# Altium schematic sheet mcu.SchDoc (part 2 of 2)
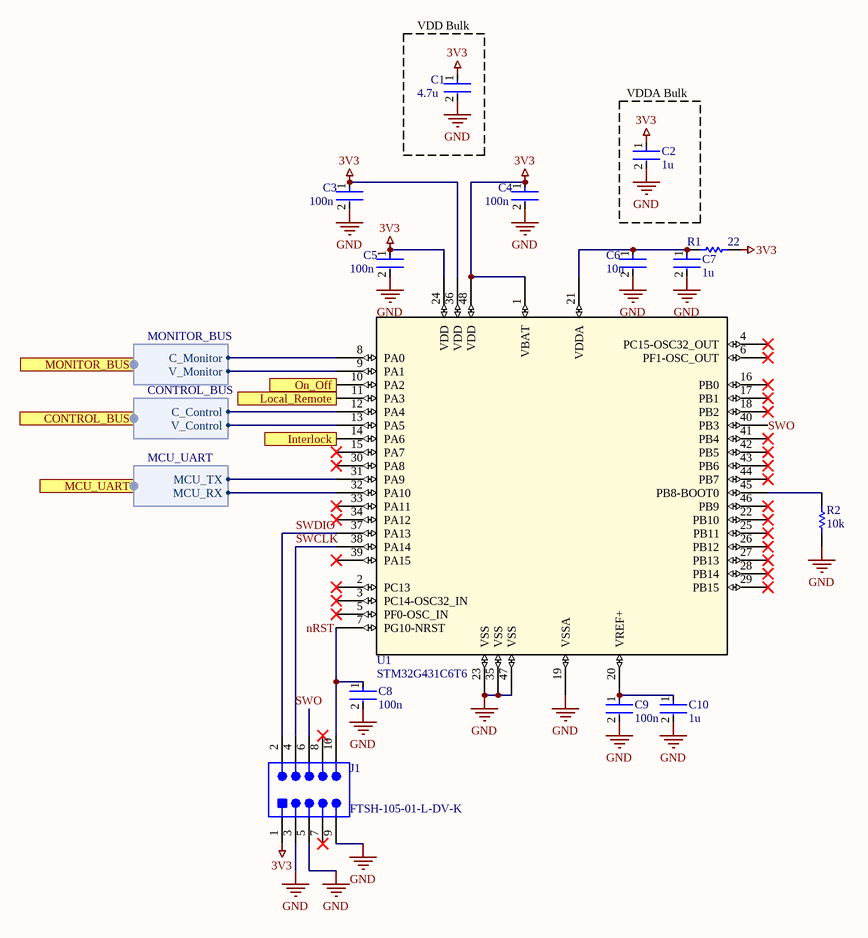
[diagram p1: mcu.SchDoc]

## Library data of the parts
C1 = CC0805KKX5R5BB475: Surface Mount Ceramic Multilayer Capacitor 4.7uF 10% X5R 6.3V 0805 Blister T/R; Manufacturer: Yageo Group; Manufacturer Package Identifier: CC0805-0.85; Value: 4.7µF; Supplier: DigiKey; Supplier Part Number: 311-1861-1-ND; Manufacturer Part Number: CC0805KKX5R5BB475; RoHS: Compliant; Category: Ceramic Capacitors; Stock: 20325; Pricing: 1=0.2, 10=0.112, 50=0.0796, 100=0.0696, 500=0.05296, 1000=0.04784 (USD); Case/Package: 0805; Case Code (Imperial): 0805; Case Code (Metric): 2012; China RoHS: Compliant; Composition: Ceramic; Country of Origin: Mainland China, Taiwan; Depth: 1.25mm; Dielectric: X5R; Dielectric Material: Ceramic; Export Control Classification Number (ECCN) Code: EAR99; Halogen Free: Halogen Free; Height: 1.25mm; Harmonized Tariff Schedule (HTS) Code: 8532.24.00.20; Introduction Date: 2006-06-01; Lead Free: Lead Free; Length: 2mm; Lifecycle Status: Production; Material: Ceramic; Max Operating Temperature: 85°C; Min Operating Temperature: -55°C; Mounting Technology: Surface Mount; Pins: 2; Number of Terminals: 2; Packaging: Tape & Reel (TR); Radiation Hardening: No; REACH SVHC: Yes; Schedule B: 8532240020, 8532240020|8532240020|8532240020|8532240020|8532240020; Termination: SMD/SMT; Thickness: 1.4478mm; Tolerance: 10%; Voltage Rating: 6.3V; Voltage Rating (DC): 6.3V; Weight: 5.499807mg; Width: 1.25mm; ComponentLink1URL: https://datasheet.octopart.com:443/CC0805KKX5R5BB475-Yageo-datasheet-170350636.pdf?src-supplier=IHS; ComponentLink1Description: https://datasheet.octopart.com:443/CC0805KKX5R5BB475-Yageo-datasheet-170350636.pdf?src-supplier=IHS; ComponentLink2URL: https://datasheet.octopart.com:443/CC0805KKX5R5BB475-Yageo-datasheet-78855689.pdf?src-supplier=Upverter; ComponentLink2Description: https://datasheet.octopart.com:443/CC0805KKX5R5BB475-Yageo-datasheet-78855689.pdf?src-supplier=Upverter; ComponentLink3URL: https://datasheet.octopart.com:443/CC0805KKX5R5BB475-Yageo-datasheet-140260304.pdf?src-supplier=element14+APAC; ComponentLink3Description: https://datasheet.octopart.com:443/CC0805KKX5R5BB475-Yageo-datasheet-140260304.pdf?src-supplier=element14+APAC; ComponentLink4URL: https://datasheet.octopart.com:443/CC0805KKX5R5BB475-Yageo-datasheet-182029903.pdf?src-supplier=Farnell; ComponentLink4Description: https://datasheet.octopart.com:443/CC0805KKX5R5BB475-Yageo-datasheet-182029903.pdf?src-supplier=Farnell; ComponentLink5URL: https://datasheet.octopart.com/CC0805KKX5R5BB475-Yageo-datasheet-86397281.pdf; ComponentLink5Description: https://datasheet.octopart.com/CC0805KKX5R5BB475-Yageo-datasheet-86397281.pdf; ComponentLink6URL: https://datasheet.octopart.com:443/CC0805KKX5R5BB475-Yageo-datasheet-8324442.pdf?src-supplier=Newark; ComponentLink6Description: https://datasheet.octopart.com:443/CC0805KKX5R5BB475-Yageo-datasheet-8324442.pdf?src-supplier=Newark; ComponentLink7URL: https://datasheet.octopart.com:443/CC0805KKX5R5BB475-Yageo-datasheet-158238148.pdf?src-supplier=Newark; ComponentLink7Description: https://datasheet.octopart.com:443/CC0805KKX5R5BB475-Yageo-datasheet-158238148.pdf?src-supplier=Newark; ComponentLink8URL: https://datasheet.octopart.com:443/CC0805KKX5R5BB475-Yageo-datasheet-62067349.pdf?src-supplier=Newark; ComponentLink8Description: https://datasheet.octopart.com:443/CC0805KKX5R5BB475-Yageo-datasheet-62067349.pdf?src-supplier=Newark; ComponentLink9URL: https://datasheet.octopart.com:443/CC0805KKX5R5BB475-Yageo-Group-datasheet-184398209.pdf?src-supplier=LCSC; ComponentLink9Description: https://datasheet.octopart.com:443/CC0805KKX5R5BB475-Yageo-Group-datasheet-184398209.pdf?src-supplier=LCSC; ComponentLink10URL: https://datasheet.octopart.com:443/CC0805KKX5R5BB475-Yageo-datasheet-149070021.pdf?src-supplier=TME; ComponentLink10Description: https://datasheet.octopart.com:443/CC0805KKX5R5BB475-Yageo-datasheet-149070021.pdf?src-supplier=TME; ComponentLink11URL: https://datasheet.octopart.com:443/CC0805KKX5R5BB475-Yageo-Group-datasheet-145016144.pdf?src-supplier=ODG+(Origin+Data+Global); ComponentLink11Description: https://datasheet.octopart.com:443/CC0805KKX5R5BB475-Yageo-Group-datasheet-145016144.pdf?src-supplier=ODG+(Origin+Data+Global); ComponentLink12URL: https://datasheet.octopart.com:443/CC0805KKX5R5BB475-Yageo-datasheet-137875056.pdf?src-supplier=Future+Electronics; ComponentLink12Description: https://datasheet.octopart.com:443/CC0805KKX5R5BB475-Yageo-datasheet-137875056.pdf?src-supplier=Future+Electronics; ComponentLink13URL: https://datasheet.octopart.com:443/CC0805KKX5R5BB475-Yageo-datasheet-137700082.pdf?src-supplier=Future+Electronics; ComponentLink13Description: https://datasheet.octopart.com:443/CC0805KKX5R5BB475-Yageo-datasheet-137700082.pdf?src-supplier=Future+Electronics; ComponentLink14URL: https://datasheet.octopart.com:443/CC0805KKX5R5BB475-Yageo-datasheet-137700085.pdf?src-supplier=Future+Electronics; ComponentLink14Description: https://datasheet.octopart.com:443/CC0805KKX5R5BB475-Yageo-datasheet-137700085.pdf?src-supplier=Future+Electronics; ComponentLink15URL: https://datasheet.octopart.com:443/CC0805KKX5R5BB475-Yageo-datasheet-24580494.pdf?src-supplier=Future+Electronics; ComponentLink15Description: https://datasheet.octopart.com:443/CC0805KKX5R5BB475-Yageo-datasheet-24580494.pdf?src-supplier=Future+Electronics; ComponentLink16URL: https://datasheet.octopart.com:443/CC0805KKX5R5BB475-Yageo-datasheet-14389981.pdf?src-supplier=Future+Electronics; ComponentLink16Description: https://datasheet.octopart.com:443/CC0805KKX5R5BB475-Yageo-datasheet-14389981.pdf?src-supplier=Future+Electronics; ComponentLink17URL: https://datasheet.octopart.com:443/CC0805KKX5R5BB475-Yageo-datasheet-10911834.pdf?src-supplier=Future+Electronics; ComponentLink17Description: https://datasheet.octopart.com:443/CC0805KKX5R5BB475-Yageo-datasheet-10911834.pdf?src-supplier=Future+Electronics; ComponentLink18URL: http://sigma.octopart.com:80/conflict_mineral_statement/Yageo-company-3.pdf?src-supplier=Compliance+Statements; ComponentLink18Description: http://sigma.octopart.com:80/conflict_mineral_statement/Yageo-company-3.pdf?src-supplier=Compliance+Statements; ComponentLink19URL: http://sigma.octopart.com:80/rohs_statement/Yageo-company-2.pdf?src-supplier=Compliance+Statements; ComponentLink19Description: http://sigma.octopart.com:80/rohs_statement/Yageo-company-2.pdf?src-supplier=Compliance+Statements; Supplier 1: DigiKey; Supplier Part Number 1: 311-1861-1-ND
C2 C10 = CC0603MRX5R5BB105: 6.3V 1uF X5R ±20% 0603 Multilayer Ceramic Capacitors MLCC - SMD/SMT ROHS; Manufacturer: Yageo Group; Value: 1µF; Supplier: DigiKey; Supplier Part Number: 311-1813-1-ND; Manufacturer Part Number: CC0603MRX5R5BB105; RoHS: Compliant; Category: Ceramic Capacitors; Stock: 3638; Pricing: 1=0.14, 10=0.078, 50=0.0544, 100=0.0472, 500=0.03518, 1000=0.03148 (USD); Case/Package: 0603; Case Code (Imperial): 0603; Case Code (Metric): 1608; China RoHS: Compliant; Composition: Ceramic; Country of Origin: Mainland China, Taiwan; Depth: 800µm; Dielectric: X5R; Dielectric Material: Ceramic; Export Control Classification Number (ECCN) Code: EAR99; Halogen Free: Halogen Free; Height: 800µm; Harmonized Tariff Schedule (HTS) Code: 8532.24.00.20; Introduction Date: 2009-04-16; Lead Free: Lead Free; Length: 1.6mm; Lifecycle Status: Production; Material: Ceramic; Max Operating Temperature: 85°C; Min Operating Temperature: -55°C; Mounting Technology: Surface Mount; Pins: 2; Number of Terminals: 2; Packaging: Tape & Reel (TR); REACH SVHC: Yes; Schedule B: 8532240020, 8532240020|8532240020|8532240020|8532240020|8532240020; Termination: SMD/SMT; Thickness: 889µm; Tolerance: 20%; Voltage Rating: 6.3V; Voltage Rating (DC): 6.3V; Weight: 2.012816mg; Width: 800µm; ComponentLink1URL: https://datasheet.octopart.com:443/CC0603MRX5R5BB105-Yageo-datasheet-170350636.pdf?src-supplier=IHS; ComponentLink1Description: https://datasheet.octopart.com:443/CC0603MRX5R5BB105-Yageo-datasheet-170350636.pdf?src-supplier=IHS; ComponentLink2URL: https://datasheet.octopart.com:443/CC0603MRX5R5BB105-Yageo-datasheet-82288757.pdf?src-supplier=Upverter; ComponentLink2Description: https://datasheet.octopart.com:443/CC0603MRX5R5BB105-Yageo-datasheet-82288757.pdf?src-supplier=Upverter; ComponentLink3URL: https://datasheet.octopart.com:443/CC0603MRX5R5BB105-Yageo-datasheet-181968798.pdf?src-supplier=Farnell; ComponentLink3Description: https://datasheet.octopart.com:443/CC0603MRX5R5BB105-Yageo-datasheet-181968798.pdf?src-supplier=Farnell; ComponentLink4URL: https://datasheet.octopart.com/CC0603MRX5R5BB105-Yageo-datasheet-86397281.pdf; ComponentLink4Description: https://datasheet.octopart.com/CC0603MRX5R5BB105-Yageo-datasheet-86397281.pdf; ComponentLink5URL: https://datasheet.octopart.com:443/CC0603MRX5R5BB105-Yageo-datasheet-8324442.pdf?src-supplier=Newark; ComponentLink5Description: https://datasheet.octopart.com:443/CC0603MRX5R5BB105-Yageo-datasheet-8324442.pdf?src-supplier=Newark; ComponentLink6URL: https://datasheet.octopart.com:443/CC0603MRX5R5BB105-Yageo-Group-datasheet-184398209.pdf?src-supplier=LCSC; ComponentLink6Description: https://datasheet.octopart.com:443/CC0603MRX5R5BB105-Yageo-Group-datasheet-184398209.pdf?src-supplier=LCSC; ComponentLink7URL: https://datasheet.octopart.com:443/CC0603MRX5R5BB105-Yageo-Group-datasheet-145016144.pdf?src-supplier=ODG+(Origin+Data+Global); ComponentLink7Description: https://datasheet.octopart.com:443/CC0603MRX5R5BB105-Yageo-Group-datasheet-145016144.pdf?src-supplier=ODG+(Origin+Data+Global); ComponentLink8URL: https://datasheet.octopart.com:443/CC0603MRX5R5BB105-Yageo-datasheet-137875056.pdf?src-supplier=Future+Electronics; ComponentLink8Description: https://datasheet.octopart.com:443/CC0603MRX5R5BB105-Yageo-datasheet-137875056.pdf?src-supplier=Future+Electronics; ComponentLink9URL: https://datasheet.octopart.com:443/CC0603MRX5R5BB105-Yageo-datasheet-137700082.pdf?src-supplier=Future+Electronics; ComponentLink9Description: https://datasheet.octopart.com:443/CC0603MRX5R5BB105-Yageo-datasheet-137700082.pdf?src-supplier=Future+Electronics; ComponentLink10URL: https://datasheet.octopart.com:443/CC0603MRX5R5BB105-Yageo-datasheet-137700085.pdf?src-supplier=Future+Electronics; ComponentLink10Description: https://datasheet.octopart.com:443/CC0603MRX5R5BB105-Yageo-datasheet-137700085.pdf?src-supplier=Future+Electronics; ComponentLink11URL: https://datasheet.octopart.com:443/CC0603MRX5R5BB105-Yageo-datasheet-15895757.pdf?src-supplier=Future+Electronics; ComponentLink11Description: https://datasheet.octopart.com:443/CC0603MRX5R5BB105-Yageo-datasheet-15895757.pdf?src-supplier=Future+Electronics; ComponentLink12URL: https://datasheet.octopart.com:443/CC0603MRX5R5BB105-Yageo-datasheet-14389981.pdf?src-supplier=Future+Electronics; ComponentLink12Description: https://datasheet.octopart.com:443/CC0603MRX5R5BB105-Yageo-datasheet-14389981.pdf?src-supplier=Future+Electronics; ComponentLink13URL: https://datasheet.octopart.com:443/CC0603MRX5R5BB105-Yageo-datasheet-10911834.pdf?src-supplier=Future+Electronics; ComponentLink13Description: https://datasheet.octopart.com:443/CC0603MRX5R5BB105-Yageo-datasheet-10911834.pdf?src-supplier=Future+Electronics; ComponentLink14URL: http://sigma.octopart.com:80/conflict_mineral_statement/Yageo-company-3.pdf?src-supplier=Compliance+Statements; ComponentLink14Description: http://sigma.octopart.com:80/conflict_mineral_statement/Yageo-company-3.pdf?src-supplier=Compliance+Statements; ComponentLink15URL: http://sigma.octopart.com:80/rohs_statement/Yageo-company-2.pdf?src-supplier=Compliance+Statements; ComponentLink15Description: http://sigma.octopart.com:80/rohs_statement/Yageo-company-2.pdf?src-supplier=Compliance+Statements; Supplier 1: DigiKey; Supplier Part Number 1: 311-1813-1-ND
C3-C5 C8 C9 = CC0603KRX7R9BB104: Multilayer Ceramic Capacitor, CC Series, 0.1 - F, - 10%, X7R, 50 V, 0603 [1608 Metric]; Manufacturer: Yageo Group; Value: 100nF; Voltage: 50V; Supplier: DigiKey; Supplier Part Number: 311-1344-1-ND; Manufacturer Part Number: CC0603KRX7R9BB104; RoHS: Compliant; Category: Ceramic Capacitors; Stock: 3228292; Pricing: 1=0.1, 10=0.043, 50=0.0292, 100=0.0251, 500=0.01812, 1000=0.01598 (USD); Case/Package: 0603; Case Code (Imperial): 0603; Case Code (Metric): 1608; China RoHS: Compliant; Country of Origin: Mainland China, Taiwan; Depth: 800µm; Dielectric: X7R; Dielectric Material: Ceramic; Export Control Classification Number (ECCN) Code: EAR99; Halogen Free: Halogen Free; Height: 800µm; Harmonized Tariff Schedule (HTS) Code: 8532.24.00.20; Introduction Date: 2005-08-18; Lead Free: Lead Free; Length: 1.6mm; Lifecycle Status: Production; Material: Ceramic; Max Operating Temperature: 125°C; Min Operating Temperature: -55°C; Mounting Technology: Surface Mount; Pins: 2; Number of Terminals: 2; Radiation Hardening: No; REACH SVHC: Yes; Schedule B: 8532240020, 8532240020|8532240020, 8532240020|8532240020|8532240020, 8532240020|8532240020|8532240020|8532240020; Termination: SMD/SMT; Thickness: 889µm; Tolerance: 10%; Voltage Rating: 50V; Voltage Rating (DC): 50V; Width: 800µm; ComponentLink1URL: https://datasheet.octopart.com:443/CC0603KRX7R9BB104-Yageo-datasheet-177165144.pdf?src-supplier=IHS; ComponentLink1Description: https://datasheet.octopart.com:443/CC0603KRX7R9BB104-Yageo-datasheet-177165144.pdf?src-supplier=IHS; ComponentLink2URL: https://datasheet.octopart.com:443/CC0603KRX7R9BB104-Yageo-datasheet-82288757.pdf?src-supplier=Upverter; ComponentLink2Description: https://datasheet.octopart.com:443/CC0603KRX7R9BB104-Yageo-datasheet-82288757.pdf?src-supplier=Upverter; ComponentLink3URL: https://datasheet.octopart.com:443/CC0603KRX7R9BB104-Yageo-datasheet-68298032.pdf?src-supplier=Upverter; ComponentLink3Description: https://datasheet.octopart.com:443/CC0603KRX7R9BB104-Yageo-datasheet-68298032.pdf?src-supplier=Upverter; ComponentLink4URL: https://datasheet.octopart.com:443/CC0603KRX7R9BB104-Yageo-Group-datasheet-189192896.pdf?src-supplier=Future+Electronics; ComponentLink4Description: https://datasheet.octopart.com:443/CC0603KRX7R9BB104-Yageo-Group-datasheet-189192896.pdf?src-supplier=Future+Electronics; ComponentLink5URL: https://datasheet.octopart.com:443/CC0603KRX7R9BB104-Yageo-datasheet-12526321.pdf?src-supplier=Future+Electronics; ComponentLink5Description: https://datasheet.octopart.com:443/CC0603KRX7R9BB104-Yageo-datasheet-12526321.pdf?src-supplier=Future+Electronics; ComponentLink6URL: https://datasheet.octopart.com:443/CC0603KRX7R9BB104-Yageo-datasheet-166511530.pdf?src-supplier=Future+Electronics; ComponentLink6Description: https://datasheet.octopart.com:443/CC0603KRX7R9BB104-Yageo-datasheet-166511530.pdf?src-supplier=Future+Electronics; ComponentLink7URL: https://datasheet.octopart.com:443/CC0603KRX7R9BB104-Yageo-datasheet-137700082.pdf?src-supplier=Future+Electronics; ComponentLink7Description: https://datasheet.octopart.com:443/CC0603KRX7R9BB104-Yageo-datasheet-137700082.pdf?src-supplier=Future+Electronics; ComponentLink8URL: https://datasheet.octopart.com:443/CC0603KRX7R9BB104-Yageo-datasheet-137700084.pdf?src-supplier=Future+Electronics; ComponentLink8Description: https://datasheet.octopart.com:443/CC0603KRX7R9BB104-Yageo-datasheet-137700084.pdf?src-supplier=Future+Electronics; ComponentLink9URL: https://datasheet.octopart.com:443/CC0603KRX7R9BB104-Yageo-datasheet-27626582.pdf?src-supplier=Future+Electronics; ComponentLink9Description: https://datasheet.octopart.com:443/CC0603KRX7R9BB104-Yageo-datasheet-27626582.pdf?src-supplier=Future+Electronics; ComponentLink10URL: https://datasheet.octopart.com:443/CC0603KRX7R9BB104-Yageo-datasheet-15895757.pdf?src-supplier=Future+Electronics; ComponentLink10Description: https://datasheet.octopart.com:443/CC0603KRX7R9BB104-Yageo-datasheet-15895757.pdf?src-supplier=Future+Electronics; ComponentLink11URL: https://datasheet.octopart.com:443/CC0603KRX7R9BB104-Yageo-datasheet-8324192.pdf?src-supplier=Future+Electronics; ComponentLink11Description: https://datasheet.octopart.com:443/CC0603KRX7R9BB104-Yageo-datasheet-8324192.pdf?src-supplier=Future+Electronics; ComponentLink12URL: https://datasheet.octopart.com/CC0603KRX7R9BB104-Yageo-datasheet-10883670.pdf; ComponentLink12Description: https://datasheet.octopart.com/CC0603KRX7R9BB104-Yageo-datasheet-10883670.pdf; ComponentLink13URL: https://datasheet.octopart.com:443/CC0603KRX7R9BB104-Yageo-datasheet-181968726.pdf?src-supplier=Newark; ComponentLink13Description: https://datasheet.octopart.com:443/CC0603KRX7R9BB104-Yageo-datasheet-181968726.pdf?src-supplier=Newark; ComponentLink14URL: https://datasheet.octopart.com:443/CC0603KRX7R9BB104-Yageo-datasheet-499490.pdf?src-supplier=Newark; ComponentLink14Description: https://datasheet.octopart.com:443/CC0603KRX7R9BB104-Yageo-datasheet-499490.pdf?src-supplier=Newark; ComponentLink15URL: https://datasheet.octopart.com:443/CC0603KRX7R9BB104-Yageo-datasheet-62336348.pdf?src-supplier=Newark; ComponentLink15Description: https://datasheet.octopart.com:443/CC0603KRX7R9BB104-Yageo-datasheet-62336348.pdf?src-supplier=Newark; ComponentLink16URL: https://datasheet.octopart.com:443/CC0603KRX7R9BB104-Yageo-datasheet-147453679.pdf?src-supplier=Newark; ComponentLink16Description: https://datasheet.octopart.com:443/CC0603KRX7R9BB104-Yageo-datasheet-147453679.pdf?src-supplier=Newark; ComponentLink17URL: https://datasheet.octopart.com:443/CC0603KRX7R9BB104-Yageo-datasheet-151948686.pdf?src-supplier=Farnell; ComponentLink17Description: https://datasheet.octopart.com:443/CC0603KRX7R9BB104-Yageo-datasheet-151948686.pdf?src-supplier=Farnell; ComponentLink18URL: https://datasheet.octopart.com:443/CC0603KRX7R9BB104-Yageo-datasheet-500777.pdf?src-supplier=Farnell; ComponentLink18Description: https://datasheet.octopart.com:443/CC0603KRX7R9BB104-Yageo-datasheet-500777.pdf?src-supplier=Farnell; ComponentLink19URL: https://datasheet.octopart.com:443/CC0603KRX7R9BB104-Yageo-datasheet-178019014.pdf?src-supplier=Burklin+Elektronik; ComponentLink19Description: https://datasheet.octopart.com:443/CC0603KRX7R9BB104-Yageo-datasheet-178019014.pdf?src-supplier=Burklin+Elektronik; ComponentLink20URL: https://datasheet.octopart.com:443/CC0603KRX7R9BB104-Yageo-Group-datasheet-165992755.pdf?src-supplier=ODG+(Origin+Data+Global); ComponentLink20Description: https://datasheet.octopart.com:443/CC0603KRX7R9BB104-Yageo-Group-datasheet-165992755.pdf?src-supplier=ODG+(Origin+Data+Global); ComponentLink21URL: https://datasheet.octopart.com:443/CC0603KRX7R9BB104-Yageo-datasheet-140260305.pdf?src-supplier=SOS+electronic; ComponentLink21Description: https://datasheet.octopart.com:443/CC0603KRX7R9BB104-Yageo-datasheet-140260305.pdf?src-supplier=SOS+electronic; ComponentLink22URL: https://datasheet.octopart.com:443/CC0603KRX7R9BB104-Yageo-datasheet-120101875.pdf?src-supplier=Megastar; ComponentLink22Description: https://datasheet.octopart.com:443/CC0603KRX7R9BB104-Yageo-datasheet-120101875.pdf?src-supplier=Megastar; ComponentLink23URL: https://datasheet.octopart.com:443/CC0603KRX7R9BB104-Yageo-datasheet-8701427.pdf?src-supplier=element14; ComponentLink23Description: https://datasheet.octopart.com:443/CC0603KRX7R9BB104-Yageo-datasheet-8701427.pdf?src-supplier=element14; ComponentLink24URL: https://datasheet.octopart.com:443/CC0603KRX7R9BB104-Yageo-datasheet-5301394.pdf?src-supplier=element14; ComponentLink24Description: https://datasheet.octopart.com:443/CC0603KRX7R9BB104-Yageo-datasheet-5301394.pdf?src-supplier=element14; ComponentLink25URL: https://datasheet.octopart.com:443/CC0603KRX7R9BB104-Yageo-datasheet-17600895.pdf?src-supplier=TME; ComponentLink25Description: https://datasheet.octopart.com:443/CC0603KRX7R9BB104-Yageo-datasheet-17600895.pdf?src-supplier=TME; ComponentLink26URL: http://sigma.octopart.com:80/15889575/rohs_statement/Yageo-CC0603KRX7R9BB104.pdf?src-supplier=Compliance+Statements; ComponentLink26Description: http://sigma.octopart.com:80/15889575/rohs_statement/Yageo-CC0603KRX7R9BB104.pdf?src-supplier=Compliance+Statements; ComponentLink27URL: http://sigma.octopart.com:80/conflict_mineral_statement/Yageo-company-3.pdf?src-supplier=Compliance+Statements; ComponentLink27Description: http://sigma.octopart.com:80/conflict_mineral_statement/Yageo-company-3.pdf?src-supplier=Compliance+Statements; Supplier 1: DigiKey; Supplier Part Number 1: 311-1344-1-ND
C6 = CC0603MRX7R9BB103: 50V 10nF X7R ±20% 0603 Multilayer Ceramic Capacitors MLCC - SMD/SMT ROHS; Manufacturer: Yageo Group; Supplier: DigiKey; Supplier Part Number: 311-1826-1-ND; Manufacturer Part Number: CC0603MRX7R9BB103; RoHS: Compliant; Category: Ceramic Capacitors; Stock: 1798; Pricing: 1=0.1, 10=0.032, 50=0.0214, 100=0.0182, 500=0.01294, 1000=0.01133 (USD); Value: 10nF; Case/Package: 0603; Case Code (Imperial): 0603; Case Code (Metric): 1608; China RoHS: Compliant; Composition: Ceramic; Country of Origin: Mainland China, Taiwan; Depth: 800µm; Dielectric: X7R; Dielectric Material: Ceramic; Export Control Classification Number (ECCN) Code: EAR99; Halogen Free: Halogen Free; Height: 800µm; Harmonized Tariff Schedule (HTS) Code: 8532.24.00.20; Introduction Date: 2009-04-17; Lead Free: Lead Free; Length: 1.6mm; Lifecycle Status: Production; Material: Ceramic; Max Operating Temperature: 125°C; Min Operating Temperature: -55°C; Mounting Technology: Surface Mount; Pins: 2; Number of Terminals: 2; Packaging: Tape and Reel; Radiation Hardening: No; REACH SVHC: Yes; Schedule B: 8532240020, 8532240020|8532240020|8532240020|8532240020|8532240020; Termination: SMD/SMT; Thickness: 889µm; Tolerance: 20%; Voltage Rating: 50V; Voltage Rating (DC): 50V; Weight: 2.012816mg; Width: 800µm; ComponentLink1URL: https://datasheet.octopart.com:443/CC0603MRX7R9BB103-Yageo-datasheet-177165144.pdf?src-supplier=IHS; ComponentLink1Description: https://datasheet.octopart.com:443/CC0603MRX7R9BB103-Yageo-datasheet-177165144.pdf?src-supplier=IHS; ComponentLink2URL: https://datasheet.octopart.com:443/CC0603MRX7R9BB103-Yageo-datasheet-82288757.pdf?src-supplier=Upverter; ComponentLink2Description: https://datasheet.octopart.com:443/CC0603MRX7R9BB103-Yageo-datasheet-82288757.pdf?src-supplier=Upverter; ComponentLink3URL: https://datasheet.octopart.com:443/CC0603MRX7R9BB103-Yageo-datasheet-147453679.pdf?src-supplier=Farnell; ComponentLink3Description: https://datasheet.octopart.com:443/CC0603MRX7R9BB103-Yageo-datasheet-147453679.pdf?src-supplier=Farnell; ComponentLink4URL: https://datasheet.octopart.com:443/CC0603MRX7R9BB103-Yageo-datasheet-182029748.pdf?src-supplier=Farnell; ComponentLink4Description: https://datasheet.octopart.com:443/CC0603MRX7R9BB103-Yageo-datasheet-182029748.pdf?src-supplier=Farnell; ComponentLink5URL: https://datasheet.octopart.com:443/CC0603MRX7R9BB103-Yageo-datasheet-182029747.pdf?src-supplier=Farnell; ComponentLink5Description: https://datasheet.octopart.com:443/CC0603MRX7R9BB103-Yageo-datasheet-182029747.pdf?src-supplier=Farnell; ComponentLink6URL: https://datasheet.octopart.com:443/CC0603MRX7R9BB103-Yageo-datasheet-151948686.pdf?src-supplier=Farnell; ComponentLink6Description: https://datasheet.octopart.com:443/CC0603MRX7R9BB103-Yageo-datasheet-151948686.pdf?src-supplier=Farnell; ComponentLink7URL: https://datasheet.octopart.com:443/CC0603MRX7R9BB103-Yageo-datasheet-62336348.pdf?src-supplier=element14+APAC; ComponentLink7Description: https://datasheet.octopart.com:443/CC0603MRX7R9BB103-Yageo-datasheet-62336348.pdf?src-supplier=element14+APAC; ComponentLink8URL: https://datasheet.octopart.com/CC0603MRX7R9BB103-Yageo-datasheet-10883670.pdf; ComponentLink8Description: https://datasheet.octopart.com/CC0603MRX7R9BB103-Yageo-datasheet-10883670.pdf; ComponentLink9URL: https://datasheet.octopart.com:443/CC0603MRX7R9BB103-Yageo-datasheet-166511530.pdf?src-supplier=Future+Electronics; ComponentLink9Description: https://datasheet.octopart.com:443/CC0603MRX7R9BB103-Yageo-datasheet-166511530.pdf?src-supplier=Future+Electronics; ComponentLink10URL: https://datasheet.octopart.com:443/CC0603MRX7R9BB103-Yageo-datasheet-137700082.pdf?src-supplier=Future+Electronics; ComponentLink10Description: https://datasheet.octopart.com:443/CC0603MRX7R9BB103-Yageo-datasheet-137700082.pdf?src-supplier=Future+Electronics; ComponentLink11URL: https://datasheet.octopart.com:443/CC0603MRX7R9BB103-Yageo-datasheet-27626582.pdf?src-supplier=Future+Electronics; ComponentLink11Description: https://datasheet.octopart.com:443/CC0603MRX7R9BB103-Yageo-datasheet-27626582.pdf?src-supplier=Future+Electronics; ComponentLink12URL: https://datasheet.octopart.com:443/CC0603MRX7R9BB103-Yageo-datasheet-15895757.pdf?src-supplier=Future+Electronics; ComponentLink12Description: https://datasheet.octopart.com:443/CC0603MRX7R9BB103-Yageo-datasheet-15895757.pdf?src-supplier=Future+Electronics; ComponentLink13URL: https://datasheet.octopart.com:443/CC0603MRX7R9BB103-Yageo-datasheet-12526321.pdf?src-supplier=Future+Electronics; ComponentLink13Description: https://datasheet.octopart.com:443/CC0603MRX7R9BB103-Yageo-datasheet-12526321.pdf?src-supplier=Future+Electronics; ComponentLink14URL: https://datasheet.octopart.com:443/CC0603MRX7R9BB103-Yageo-datasheet-10882999.pdf?src-supplier=Future+Electronics; ComponentLink14Description: https://datasheet.octopart.com:443/CC0603MRX7R9BB103-Yageo-datasheet-10882999.pdf?src-supplier=Future+Electronics; ComponentLink15URL: https://datasheet.octopart.com:443/CC0603MRX7R9BB103-Yageo-Group-datasheet-165992755.pdf?src-supplier=ODG+(Origin+Data+Global); ComponentLink15Description: https://datasheet.octopart.com:443/CC0603MRX7R9BB103-Yageo-Group-datasheet-165992755.pdf?src-supplier=ODG+(Origin+Data+Global); ComponentLink16URL: http://sigma.octopart.com:80/conflict_mineral_statement/Yageo-company-3.pdf?src-supplier=Compliance+Statements; ComponentLink16Description: http://sigma.octopart.com:80/conflict_mineral_statement/Yageo-company-3.pdf?src-supplier=Compliance+Statements; ComponentLink17URL: http://sigma.octopart.com:80/rohs_statement/Yageo-company-2.pdf?src-supplier=Compliance+Statements; ComponentLink17Description: http://sigma.octopart.com:80/rohs_statement/Yageo-company-2.pdf?src-supplier=Compliance+Statements; Supplier 1: DigiKey; Supplier Part Number 1: 311-1826-1-ND
C7 = CC0805KKX5R5BB105: 6.3V 1uF X5R ±10% 0805 Multilayer Ceramic Capacitors MLCC - SMD/SMT ROHS; Manufacturer: Yageo Group; Manufacturer Package Identifier: CC0805-0.85; Value: 1µF; Supplier: DigiKey; Supplier Part Number: 311-3417-1-ND; Manufacturer Part Number: CC0805KKX5R5BB105; RoHS: Compliant; Category: Ceramic Capacitors; Stock: 24303; Pricing: 1=0.17, 10=0.096, 50=0.0676, 100=0.059, 500=0.0445, 1000=0.04003 (USD); Case/Package: 0805; China RoHS: Compliant; Country of Origin: Mainland China, Taiwan; Dielectric: X5R; Dielectric Material: Ceramic; Export Control Classification Number (ECCN) Code: EAR99; Halogen Free: Halogen Free; Height: 1.25mm; Harmonized Tariff Schedule (HTS) Code: 8532.24.00.20; Introduction Date: 2009-04-16; Lead Free: Lead Free; Length: 2mm; Lifecycle Status: Production; Material: Ceramic; Max Operating Temperature: 85°C; Min Operating Temperature: -55°C; Mounting Technology: Surface Mount; Number of Terminals: 2; REACH SVHC: Yes; Schedule B: 8532240020, 8532240020|8532240020, 8532240020|8532240020|8532240020, 8532240020|8532240020|8532240020|8532240020; Thickness: 1.4478mm; Tolerance: 10%; Voltage Rating: 6.3V; Voltage Rating (DC): 6.3V; Width: 1.25mm; ComponentLink1URL: https://datasheet.octopart.com:443/CC0805KKX5R5BB105-Yageo-datasheet-170350636.pdf?src-supplier=IHS; ComponentLink1Description: https://datasheet.octopart.com:443/CC0805KKX5R5BB105-Yageo-datasheet-170350636.pdf?src-supplier=IHS; ComponentLink2URL: https://datasheet.octopart.com:443/CC0805KKX5R5BB105-Yageo-datasheet-78855689.pdf?src-supplier=Upverter; ComponentLink2Description: https://datasheet.octopart.com:443/CC0805KKX5R5BB105-Yageo-datasheet-78855689.pdf?src-supplier=Upverter; ComponentLink3URL: https://datasheet.octopart.com:443/CC0805KKX5R5BB105-Yageo-datasheet-182965640.pdf?src-supplier=Farnell; ComponentLink3Description: https://datasheet.octopart.com:443/CC0805KKX5R5BB105-Yageo-datasheet-182965640.pdf?src-supplier=Farnell; ComponentLink4URL: https://datasheet.octopart.com:443/CC0805KKX5R5BB105-Yageo-Group-datasheet-184398209.pdf?src-supplier=LCSC; ComponentLink4Description: https://datasheet.octopart.com:443/CC0805KKX5R5BB105-Yageo-Group-datasheet-184398209.pdf?src-supplier=LCSC; ComponentLink5URL: https://datasheet.octopart.com:443/CC0805KKX5R5BB105-Yageo-Group-datasheet-145016144.pdf?src-supplier=ODG+(Origin+Data+Global); ComponentLink5Description: https://datasheet.octopart.com:443/CC0805KKX5R5BB105-Yageo-Group-datasheet-145016144.pdf?src-supplier=ODG+(Origin+Data+Global); ComponentLink6URL: https://datasheet.octopart.com/CC0805KKX5R5BB105-Yageo-datasheet-86397281.pdf; ComponentLink6Description: https://datasheet.octopart.com/CC0805KKX5R5BB105-Yageo-datasheet-86397281.pdf; ComponentLink7URL: http://sigma.octopart.com:80/conflict_mineral_statement/Yageo-company-3.pdf?src-supplier=Compliance+Statements; ComponentLink7Description: http://sigma.octopart.com:80/conflict_mineral_statement/Yageo-company-3.pdf?src-supplier=Compliance+Statements; ComponentLink8URL: http://sigma.octopart.com:80/rohs_statement/Yageo-company-2.pdf?src-supplier=Compliance+Statements; ComponentLink8Description: http://sigma.octopart.com:80/rohs_statement/Yageo-company-2.pdf?src-supplier=Compliance+Statements; Supplier 1: DigiKey; Supplier Part Number 1: 311-3417-1-ND
J1 = FTSH-105-01-L-DV-K: CONN HEADER SMD 10POS 1.27MM / Connector Header Surface Mount 10 position 0.050" (1.27mm); Manufacturer: Samtec; Manufacturer Lifecycle Status: PRODUCTION; Connector Type: Male Pin; Gender: Female; Max Current Rating: 1.75A; Number of Contacts: 10; Supplier: DigiKey; Supplier Part Number: SAM8799-ND; Manufacturer Part Number: FTSH-105-01-L-DV-K; RoHS: Compliant; Category: Headers and Wire Housings; Stock: 73552; Pricing: 1=1.37, 100=1.075, 250=0.972, 500=0.855, 1000=0.753, 2500=0.68, 5000=0.607, 10000=0.52375 (USD); Color: Black; Contact Material: Bronze; Contact Mating Length: 3.048mm; Contact Plating: Gold; Depth: 3.43mm; Housing Color: Black; Housing Material: Polymer; Lead Free: Lead Free; Length: 6.35mm; Lifecycle Status: Production; Max Operating Temperature: 125°C; Min Operating Temperature: -55°C; Mounting Technology: Surface Mount; Pins: 10; Number of Positions: 10; Number of Rows: 2; Pitch: 1.27mm; Radiation Hardening: No; REACH SVHC: No; Row Spacing: 1.27mm; Termination: Solder; ComponentLink1URL: https://datasheet.octopart.com:443/FTSH-105-01-L-DV-K-Samtec-datasheet-140825048.pdf?src-supplier=Electro+Sonic; ComponentLink1Description: https://datasheet.octopart.com:443/FTSH-105-01-L-DV-K-Samtec-datasheet-140825048.pdf?src-supplier=Electro+Sonic; ComponentLink2URL: https://datasheet.octopart.com:443/FTSH-105-01-L-DV-K-Samtec-datasheet-86818370.pdf?src-supplier=Upverter; ComponentLink2Description: https://datasheet.octopart.com:443/FTSH-105-01-L-DV-K-Samtec-datasheet-86818370.pdf?src-supplier=Upverter; ComponentLink3URL: https://datasheet.octopart.com:443/FTSH-105-01-L-DV-K-Samtec-datasheet-97029545.pdf?src-supplier=Newark; ComponentLink3Description: https://datasheet.octopart.com:443/FTSH-105-01-L-DV-K-Samtec-datasheet-97029545.pdf?src-supplier=Newark; ComponentLink4URL: https://datasheet.octopart.com:443/FTSH-105-01-L-DV-K-Samtec-datasheet-41642889.pdf?src-supplier=Newark; ComponentLink4Description: https://datasheet.octopart.com:443/FTSH-105-01-L-DV-K-Samtec-datasheet-41642889.pdf?src-supplier=Newark; ComponentLink5URL: https://sigma.octopart.com:443/140871554/technical_drawing/Samtec-FTSH-105-01-L-DV-K.pdf?src-supplier=Samtec; ComponentLink5Description: https://sigma.octopart.com:443/140871554/technical_drawing/Samtec-FTSH-105-01-L-DV-K.pdf?src-supplier=Samtec; ComponentLink6URL: https://sigma.octopart.com:443/97029548/technical_drawing/Samtec-FTSH-105-01-L-DV-K.pdf?src-supplier=Samtec; ComponentLink6Description: https://sigma.octopart.com:443/97029548/technical_drawing/Samtec-FTSH-105-01-L-DV-K.pdf?src-supplier=Samtec; ComponentLink7URL: https://datasheet.octopart.com:443/FTSH-105-01-L-DV-K-Samtec-datasheet-100454331.pdf?src-supplier=Farnell; ComponentLink7Description: https://datasheet.octopart.com:443/FTSH-105-01-L-DV-K-Samtec-datasheet-100454331.pdf?src-supplier=Farnell; ComponentLink8URL: https://datasheet.octopart.com:443/FTSH-105-01-L-DV-K-Samtec-datasheet-33007714.pdf?src-supplier=Farnell; ComponentLink8Description: https://datasheet.octopart.com:443/FTSH-105-01-L-DV-K-Samtec-datasheet-33007714.pdf?src-supplier=Farnell; ComponentLink9URL: https://datasheet.octopart.com:443/FTSH-105-01-L-DV-K-Samtec-datasheet-16646209.pdf?src-supplier=element14+APAC; ComponentLink9Description: https://datasheet.octopart.com:443/FTSH-105-01-L-DV-K-Samtec-datasheet-16646209.pdf?src-supplier=element14+APAC; ComponentLink10URL: https://datasheet.octopart.com:443/FTSH-105-01-L-DV-K-Samtec-datasheet-180249087.pdf?src-supplier=JRH+Electronics; ComponentLink10Description: https://datasheet.octopart.com:443/FTSH-105-01-L-DV-K-Samtec-datasheet-180249087.pdf?src-supplier=JRH+Electronics; ComponentLink11URL: https://datasheet.octopart.com:443/FTSH-105-01-L-DV-K-Samtec-datasheet-176663386.pdf?src-supplier=Toby+Electronics; ComponentLink11Description: https://datasheet.octopart.com:443/FTSH-105-01-L-DV-K-Samtec-datasheet-176663386.pdf?src-supplier=Toby+Electronics; ComponentLink12URL: https://datasheet.octopart.com:443/FTSH-105-01-L-DV-K-Samtec-datasheet-133497664.pdf?src-supplier=Toby+Electronics; ComponentLink12Description: https://datasheet.octopart.com:443/FTSH-105-01-L-DV-K-Samtec-datasheet-133497664.pdf?src-supplier=Toby+Electronics; ComponentLink13URL: https://datasheet.octopart.com:443/FTSH-105-01-L-DV-K-Samtec-datasheet-116535196.pdf?src-supplier=Toby+Electronics; ComponentLink13Description: https://datasheet.octopart.com:443/FTSH-105-01-L-DV-K-Samtec-datasheet-116535196.pdf?src-supplier=Toby+Electronics; ComponentLink14URL: https://datasheet.octopart.com:443/FTSH-105-01-L-DV-K-Samtec-datasheet-151470459.pdf?src-supplier=Sager+Electronics; ComponentLink14Description: https://datasheet.octopart.com:443/FTSH-105-01-L-DV-K-Samtec-datasheet-151470459.pdf?src-supplier=Sager+Electronics; ComponentLink15URL: https://datasheet.octopart.com:443/FTSH-105-01-L-DV-K-Samtec-datasheet-151470458.pdf?src-supplier=Sager+Electronics; ComponentLink15Description: https://datasheet.octopart.com:443/FTSH-105-01-L-DV-K-Samtec-datasheet-151470458.pdf?src-supplier=Sager+Electronics; ComponentLink16URL: https://datasheet.octopart.com:443/FTSH-105-01-L-DV-K-Samtec-datasheet-137316104.pdf?src-supplier=Future+Electronics; ComponentLink16Description: https://datasheet.octopart.com:443/FTSH-105-01-L-DV-K-Samtec-datasheet-137316104.pdf?src-supplier=Future+Electronics; ComponentLink17URL: https://datasheet.octopart.com/FTSH-105-01-L-DV-K-Samtec-datasheet-13696953.pdf; ComponentLink17Description: https://datasheet.octopart.com/FTSH-105-01-L-DV-K-Samtec-datasheet-13696953.pdf; ComponentLink18URL: https://datasheet.octopart.com/FTSH-105-01-L-DV-K-Samtec-datasheet-11553404.pdf; ComponentLink18Description: https://datasheet.octopart.com/FTSH-105-01-L-DV-K-Samtec-datasheet-11553404.pdf; Supplier 1: DigiKey; Supplier Part Number 1: SAM8799-ND
R1 = RC0805FR-0722RL: 125mW Thick Film Resistors 150V ±100ppm/℃ ±1% 22Ω 0805 Chip Resistor - Surface Mount ROHS; Manufacturer: Yageo Group; Temperature Coefficient: 100ppm/°C; Supplier: DigiKey; Supplier Part Number: 311-22.0CRCT-ND; Manufacturer Part Number: RC0805FR-0722RL; RoHS: Compliant; Category: Chip SMD Resistors; Stock: 424407; Pricing: 1=0.1, 10=0.034, 25=0.0256, 50=0.0208, 100=0.0171, 250=0.01344, 500=0.01136, 1000=0.00973 (USD); Case/Package: 0805; Case Code (Imperial): 0805; China RoHS: Non-Compliant; Composition: Thick Film; Contact Plating: Tin; Country of Origin: Mainland China, Taiwan; Depth: 1.25mm; Export Control Classification Number (ECCN) Code: EAR99; Features: Moisture Resistant; Height: 500µm; Harmonized Tariff Schedule (HTS) Code: 8533.21.00.30; Introduction Date: 2004-09-22; Lead Free: Lead Free; Length: 2mm; Lifecycle Status: Production; Max Operating Temperature: 155°C; Max Power Dissipation: 125mW; Military Standard: Not; Min Operating Temperature: -55°C; Mounting Technology: Surface Mount; Pins: 2; Number of Terminals: 2; Number of Terminations: 2; Packaging: Tape & Reel; Power Rating: 125mW; Radiation Hardening: No; REACH SVHC: Yes; Value: 22Ω; Schedule B: 8533210045, 8533210045|8533210045, 8533210045|8533210045|8533210045, 8533210045|8533210045|8533210045|8533210045; Termination: SMD/SMT; Tolerance: 1%; Voltage Rating: 150V; Voltage Rating (AC): 150V; Voltage Rating (DC): 150V; Width: 1.25mm; Working Voltage: 150V; ComponentLink1URL: https://datasheet.octopart.com:443/RC0805FR-0722RL-Yageo-datasheet-175887523.pdf?src-supplier=IHS; ComponentLink1Description: https://datasheet.octopart.com:443/RC0805FR-0722RL-Yageo-datasheet-175887523.pdf?src-supplier=IHS; ComponentLink2URL: https://datasheet.octopart.com:443/RC0805FR-0722RL-Yageo-datasheet-103092701.pdf?src-supplier=Upverter; ComponentLink2Description: https://datasheet.octopart.com:443/RC0805FR-0722RL-Yageo-datasheet-103092701.pdf?src-supplier=Upverter; ComponentLink3URL: https://datasheet.octopart.com:443/RC0805FR-0722RL-Yageo-datasheet-79472498.pdf?src-supplier=Upverter; ComponentLink3Description: https://datasheet.octopart.com:443/RC0805FR-0722RL-Yageo-datasheet-79472498.pdf?src-supplier=Upverter; ComponentLink4URL: https://datasheet.octopart.com:443/RC0805FR-0722RL-Yageo-datasheet-8330313.pdf?src-supplier=element14+APAC; ComponentLink4Description: https://datasheet.octopart.com:443/RC0805FR-0722RL-Yageo-datasheet-8330313.pdf?src-supplier=element14+APAC; ComponentLink5URL: https://datasheet.octopart.com:443/RC0805FR-0722RL-Yageo-datasheet-62067350.pdf?src-supplier=element14+APAC; ComponentLink5Description: https://datasheet.octopart.com:443/RC0805FR-0722RL-Yageo-datasheet-62067350.pdf?src-supplier=element14+APAC; ComponentLink6URL: https://datasheet.octopart.com:443/RC0805FR-0722RL-Yageo-Group-datasheet-176638170.pdf?src-supplier=Future+Electronics; ComponentLink6Description: https://datasheet.octopart.com:443/RC0805FR-0722RL-Yageo-Group-datasheet-176638170.pdf?src-supplier=Future+Electronics; ComponentLink7URL: https://datasheet.octopart.com:443/RC0805FR-0722RL-Yageo-datasheet-164759695.pdf?src-supplier=Future+Electronics; ComponentLink7Description: https://datasheet.octopart.com:443/RC0805FR-0722RL-Yageo-datasheet-164759695.pdf?src-supplier=Future+Electronics; ComponentLink8URL: https://datasheet.octopart.com:443/RC0805FR-0722RL-Yageo-datasheet-12592811.pdf?src-supplier=Future+Electronics; ComponentLink8Description: https://datasheet.octopart.com:443/RC0805FR-0722RL-Yageo-datasheet-12592811.pdf?src-supplier=Future+Electronics; ComponentLink9URL: https://datasheet.octopart.com:443/RC0805FR-0722RL-Yageo-datasheet-8324252.pdf?src-supplier=Future+Electronics; ComponentLink9Description: https://datasheet.octopart.com:443/RC0805FR-0722RL-Yageo-datasheet-8324252.pdf?src-supplier=Future+Electronics; ComponentLink10URL: https://datasheet.octopart.com/RC0805FR-0722RL-Yageo-datasheet-73766026.pdf; ComponentLink10Description: https://datasheet.octopart.com/RC0805FR-0722RL-Yageo-datasheet-73766026.pdf; ComponentLink11URL: https://datasheet.octopart.com:443/RC0805FR-0722RL-Yageo-datasheet-13691069.pdf?src-supplier=Farnell; ComponentLink11Description: https://datasheet.octopart.com:443/RC0805FR-0722RL-Yageo-datasheet-13691069.pdf?src-supplier=Farnell; ComponentLink12URL: https://datasheet.octopart.com:443/RC0805FR-0722RL-Yageo-datasheet-118657.pdf?src-supplier=DigiKey; ComponentLink12Description: https://datasheet.octopart.com:443/RC0805FR-0722RL-Yageo-datasheet-118657.pdf?src-supplier=DigiKey; ComponentLink13URL: http://sigma.octopart.com:80/conflict_mineral_statement/Yageo-company-3.pdf?src-supplier=Compliance+Statements; ComponentLink13Description: http://sigma.octopart.com:80/conflict_mineral_statement/Yageo-company-3.pdf?src-supplier=Compliance+Statements; ComponentLink14URL: http://sigma.octopart.com:80/rohs_statement/Yageo-company-2.pdf?src-supplier=Compliance+Statements; ComponentLink14Description: http://sigma.octopart.com:80/rohs_statement/Yageo-company-2.pdf?src-supplier=Compliance+Statements; Supplier 1: DigiKey; Supplier Part Number 1: 311-22.0CRCT-ND
R2 = RC0805FR-0710KL: Res General Purpose Thick Film 0805 10k Ohm 1% 1/8W ±100ppm/°C Ceramic Paper T/R; Manufacturer: Yageo Group; Max Power Dissipation: 125mW; Value: 10kΩ; Voltage Rating: 150V; Supplier: DigiKey; Supplier Part Number: 311-10.0KCRCT-ND; Manufacturer Part Number: RC0805FR-0710KL; RoHS: Compliant; Category: Chip SMD Resistors; Stock: 4083661; Pricing: 1=0.1, 10=0.034, 25=0.0256, 50=0.0208, 100=0.0171, 250=0.01344, 500=0.01136, 1000=0.00973 (USD); Case/Package: 0805; Case Code (Imperial): 0805; China RoHS: Non-Compliant; Composition: Thick Film; Contact Plating: Tin; Country of Origin: Mainland China, Taiwan; Depth: 1.25mm; Export Control Classification Number (ECCN) Code: EAR99; Features: Moisture Resistant; Height: 500µm; Harmonized Tariff Schedule (HTS) Code: 8533.21.00.30; Introduction Date: 2004-09-22; Lead Free: Lead Free; Length: 2mm; Lifecycle Status: Production; Max Operating Temperature: 155°C; Military Standard: Not; Min Operating Temperature: -55°C; Mounting Technology: Surface Mount; Pins: 2; Number of Terminals: 2; Number of Terminations: 2; Packaging: Tape and Reel; Power Rating: 125mW; Radiation Hardening: No; REACH SVHC: Yes; Schedule B: 8533210045, 8533210045|8533210045|8533210045|8533210045|8533210045|8533210045|8533210045|8533210045|8533210045|8533210045|8533210045|8533210045|8533210045|8533210045|8533210045|8533210045|8533210045|8533210045|8533210045|8533210045|8533210045|8533210045|8533210045|85; Temperature Coefficient: 100ppm/°C; Termination: SMD/SMT; Tolerance: 1%; Voltage Rating (AC): 150V; Voltage Rating (DC): 150V; Width: 1.25mm; Working Voltage: 150V; ComponentLink1URL: https://datasheet.octopart.com:443/RC0805FR-0710KL-Yageo-datasheet-175887523.pdf?src-supplier=Newark; ComponentLink1Description: https://datasheet.octopart.com:443/RC0805FR-0710KL-Yageo-datasheet-175887523.pdf?src-supplier=Newark; ComponentLink2URL: https://datasheet.octopart.com:443/RC0805FR-0710KL-Yageo-datasheet-62067350.pdf?src-supplier=Farnell; ComponentLink2Description: https://datasheet.octopart.com:443/RC0805FR-0710KL-Yageo-datasheet-62067350.pdf?src-supplier=Farnell; ComponentLink3URL: https://datasheet.octopart.com:443/RC0805FR-0710KL-Yageo-datasheet-13691069.pdf?src-supplier=Farnell; ComponentLink3Description: https://datasheet.octopart.com:443/RC0805FR-0710KL-Yageo-datasheet-13691069.pdf?src-supplier=Farnell; ComponentLink4URL: https://datasheet.octopart.com:443/RC0805FR-0710KL-Yageo-datasheet-103092701.pdf?src-supplier=Upverter; ComponentLink4Description: https://datasheet.octopart.com:443/RC0805FR-0710KL-Yageo-datasheet-103092701.pdf?src-supplier=Upverter; ComponentLink5URL: https://datasheet.octopart.com:443/RC0805FR-0710KL-Yageo-datasheet-98239111.pdf?src-supplier=Upverter; ComponentLink5Description: https://datasheet.octopart.com:443/RC0805FR-0710KL-Yageo-datasheet-98239111.pdf?src-supplier=Upverter; ComponentLink6URL: https://datasheet.octopart.com:443/RC0805FR-0710KL-Yageo---Phycomp-datasheet-67302840.pdf?src-supplier=Upverter; ComponentLink6Description: https://datasheet.octopart.com:443/RC0805FR-0710KL-Yageo---Phycomp-datasheet-67302840.pdf?src-supplier=Upverter; ComponentLink7URL: https://datasheet.octopart.com:443/RC0805FR-0710KL-Yageo-datasheet-8330313.pdf?src-supplier=element14+APAC; ComponentLink7Description: https://datasheet.octopart.com:443/RC0805FR-0710KL-Yageo-datasheet-8330313.pdf?src-supplier=element14+APAC; ComponentLink8URL: https://datasheet.octopart.com:443/RC0805FR-0710KL-Yageo-datasheet-12592811.pdf?src-supplier=element14+APAC; ComponentLink8Description: https://datasheet.octopart.com:443/RC0805FR-0710KL-Yageo-datasheet-12592811.pdf?src-supplier=element14+APAC; ComponentLink9URL: https://datasheet.octopart.com:443/RC0805FR-0710KL-Yageo-Group-datasheet-190305687.pdf?src-supplier=Future+Electronics; ComponentLink9Description: https://datasheet.octopart.com:443/RC0805FR-0710KL-Yageo-Group-datasheet-190305687.pdf?src-supplier=Future+Electronics; ComponentLink10URL: https://datasheet.octopart.com:443/RC0805FR-0710KL-Yageo-datasheet-164759695.pdf?src-supplier=Future+Electronics; ComponentLink10Description: https://datasheet.octopart.com:443/RC0805FR-0710KL-Yageo-datasheet-164759695.pdf?src-supplier=Future+Electronics; ComponentLink11URL: https://datasheet.octopart.com:443/RC0805FR-0710KL-Yageo-datasheet-15800360.pdf?src-supplier=Future+Electronics; ComponentLink11Description: https://datasheet.octopart.com:443/RC0805FR-0710KL-Yageo-datasheet-15800360.pdf?src-supplier=Future+Electronics; ComponentLink12URL: https://datasheet.octopart.com:443/RC0805FR-0710KL-Yageo-datasheet-8324252.pdf?src-supplier=Future+Electronics; ComponentLink12Description: https://datasheet.octopart.com:443/RC0805FR-0710KL-Yageo-datasheet-8324252.pdf?src-supplier=Future+Electronics; ComponentLink13URL: https://datasheet.octopart.com:443/RC0805FR-0710KL-Yageo-datasheet-79472498.pdf?src-supplier=Megastar; ComponentLink13Description: https://datasheet.octopart.com:443/RC0805FR-0710KL-Yageo-datasheet-79472498.pdf?src-supplier=Megastar; ComponentLink14URL: https://datasheet.octopart.com:443/RC0805FR-0710KL-Yageo-datasheet-27714392.pdf?src-supplier=Seeed+Studio; ComponentLink14Description: https://datasheet.octopart.com:443/RC0805FR-0710KL-Yageo-datasheet-27714392.pdf?src-supplier=Seeed+Studio; ComponentLink15URL: https://datasheet.octopart.com/RC0805FR-0710KL-Yageo-datasheet-73766026.pdf; ComponentLink15Description: https://datasheet.octopart.com/RC0805FR-0710KL-Yageo-datasheet-73766026.pdf; ComponentLink16URL: https://datasheet.octopart.com:443/RC0805FR-0710KL-Yageo-datasheet-118657.pdf?src-supplier=DigiKey; ComponentLink16Description: https://datasheet.octopart.com:443/RC0805FR-0710KL-Yageo-datasheet-118657.pdf?src-supplier=DigiKey; ComponentLink17URL: https://datasheet.octopart.com:443/RC0805FR-0710KL-Yageo-datasheet-502840.pdf?src-supplier=element14; ComponentLink17Description: https://datasheet.octopart.com:443/RC0805FR-0710KL-Yageo-datasheet-502840.pdf?src-supplier=element14; ComponentLink18URL: http://sigma.octopart.com:80/conflict_mineral_statement/Yageo-company-3.pdf?src-supplier=Compliance+Statements; ComponentLink18Description: http://sigma.octopart.com:80/conflict_mineral_statement/Yageo-company-3.pdf?src-supplier=Compliance+Statements; ComponentLink19URL: http://sigma.octopart.com:80/rohs_statement/Yageo-company-2.pdf?src-supplier=Compliance+Statements; ComponentLink19Description: http://sigma.octopart.com:80/rohs_statement/Yageo-company-2.pdf?src-supplier=Compliance+Statements; Supplier 1: DigiKey; Supplier Part Number 1: 311-10.0KCRCT-ND
U1 = STM32G431C6T6: Microcontroller 32-Bit ARM Cortex-M4 RISC 32K-Byte Flash 3.3V 48-Pin LQFP; Manufacturer: STMicroelectronics; ADC Channels (Resolution): 17-Ch 12-Bit; DAC Channels (Resolution): 4-Ch 12-Bit; EEPROM Memory Size: 0B; Flash Memory Size: 32kB; Frequency: 170MHz; Interface: USB; Clock Frequency: 48MHz; Max Supply Current: 29mA; Max Supply Voltage: 3.6V; Min Supply Voltage: 1.71V; Nominal Supply Voltage (DC): 3V; Number of A/D Converters: 2; Number of Channels: 17; Number of I2C Channels: 3; Number of I/Os: 5; Number of Interrupts: 16; Number of Timers/Counters: 12; Peripherals: POR; Supplier: DigiKey; Supplier Part Number: STM32G431C6T6-ND; Manufacturer Part Number: STM32G431C6T6; RoHS: Compliant; Category: Microcontrollers; Stock: 1643; Pricing: 1=4.96, 10=3.769, 25=3.4728, 100=3.1467, 250=2.99128, 500=2.8976, 1500=2.78186, 3000=2.72522 (USD); Case/Package: LFQFP; China RoHS: Compliant; Core Architecture: ARM Cortex-M4; Country of Origin: Mainland China, Taiwan; Export Control Classification Number (ECCN) Code: 3A991.A.2; Height - Seated (Max): 1.6mm; Harmonized Tariff Schedule (HTS) Code: 8542.31.00.25; Introduction Date: 2019-10-29; Length: 7mm; Lifecycle Status: Production; Max Operating Temperature: 85°C; Memory Format: FLASH; Min Operating Temperature: -40°C; Number of D/A Converters: 2; Number of SPI Channels: 3; Number of Terminals: 48; Number of USART Channels: 3; RAM Size: 32kB; REACH SVHC: Yes; Schedule B: 8542310000, 8542310000|8542310000|8542310000|8542310000|8542310000; Terminal Pitch: 500µm; Width: 7mm; ComponentLink1URL: https://datasheet.octopart.com:443/STM32G431C6T6-STMicroelectronics-datasheet-159144895.pdf?src-supplier=Newark; ComponentLink1Description: https://datasheet.octopart.com:443/STM32G431C6T6-STMicroelectronics-datasheet-159144895.pdf?src-supplier=Newark; ComponentLink2URL: https://datasheet.octopart.com:443/STM32G431C6T6-STMicroelectronics-datasheet-144618855.pdf?src-supplier=TME; ComponentLink2Description: https://datasheet.octopart.com:443/STM32G431C6T6-STMicroelectronics-datasheet-144618855.pdf?src-supplier=TME; Supplier 1: DigiKey; Supplier Part Number 1: STM32G431C6T6-ND